# Altium schematic sheet InterfacesB_NONISO422b.SchDoc
size A; DocumentNumber: 7; SheetNumber: 7
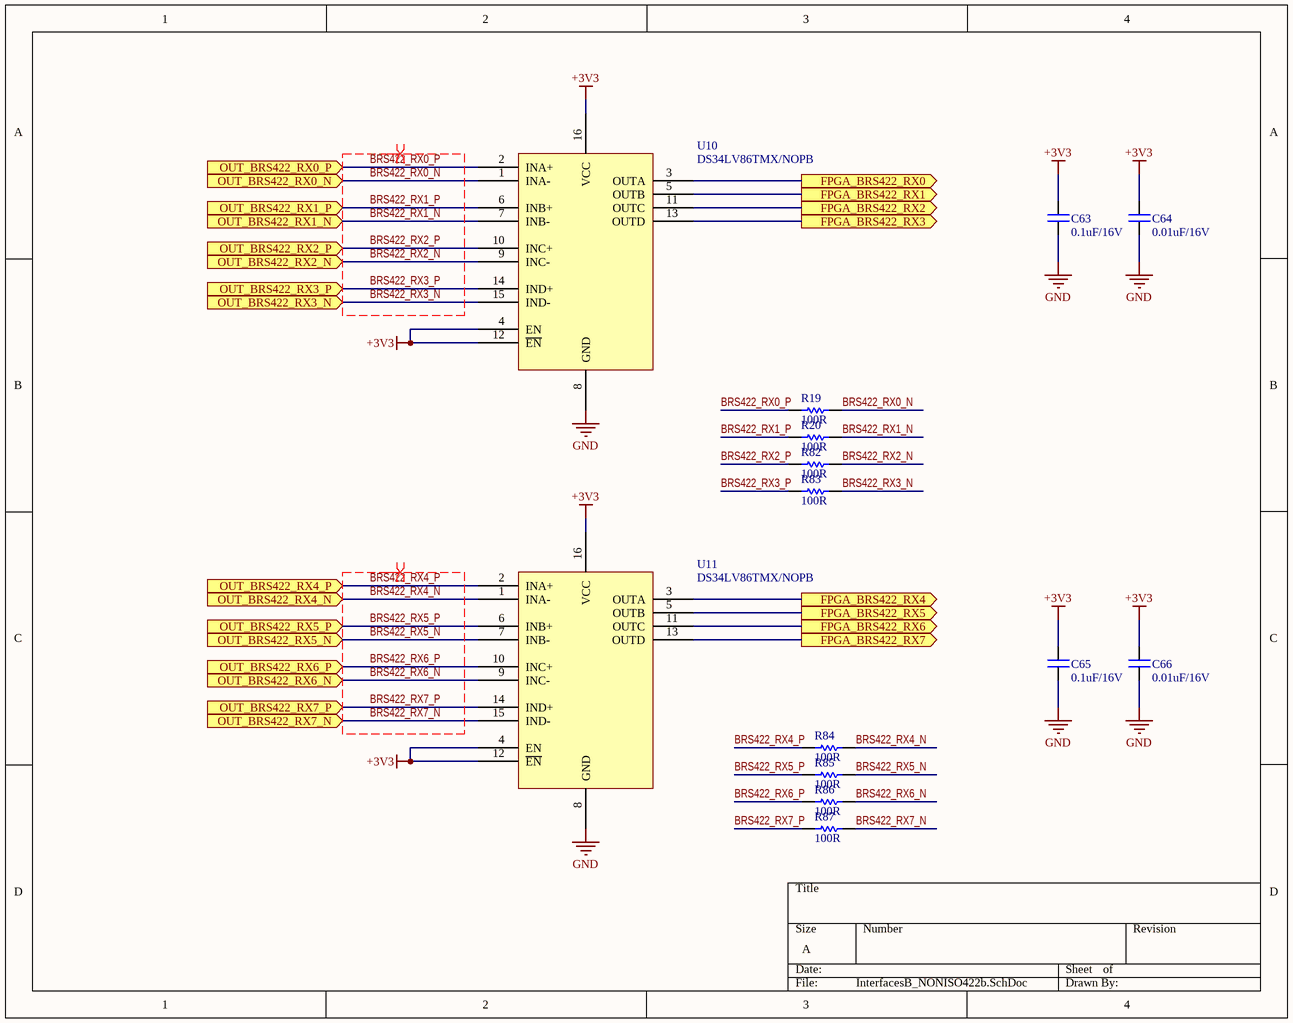
[diagram p0: InterfacesB_NONISO422b.SchDoc]

## Parts
C63  value 0.1uF/16V  [CAP_0805]  (hidden comment: CAP_0805)
C64  value 0.01uF/16V  [CAP_0805]  (hidden comment: CAP_0805)
C65  value 0.1uF/16V  [CAP_0805]  (hidden comment: CAP_0805)
C66  value 0.01uF/16V  [CAP_0805]  (hidden comment: CAP_0805)
R19  value 100R  [RES_0805]  (hidden comment: RES_0805)
R20  value 100R  [RES_0805]  (hidden comment: RES_0805)
R82  value 100R  [RES_0805]  (hidden comment: RES_0805)
R83  value 100R  [RES_0805]  (hidden comment: RES_0805)
R84  value 100R  [RES_0805]  (hidden comment: RES_0805)
R85  value 100R  [RES_0805]  (hidden comment: RES_0805)
R86  value 100R  [RES_0805]  (hidden comment: RES_0805)
R87  value 100R  [RES_0805]  (hidden comment: RES_0805)
U10  DS34LV86TMX/NOPB  [DS34LV86TMX/NOPB]
U11  DS34LV86TMX/NOPB  [DS34LV86TMX/NOPB]

## Ports
FPGA_BRS422_RX0 (out), FPGA_BRS422_RX1 (out), FPGA_BRS422_RX2 (out), FPGA_BRS422_RX3 (out), FPGA_BRS422_RX4 (out), FPGA_BRS422_RX5 (out), FPGA_BRS422_RX6 (out), FPGA_BRS422_RX7 (out), OUT_BRS422_RX0_N (in), OUT_BRS422_RX0_P (in), OUT_BRS422_RX1_N (in), OUT_BRS422_RX1_P (in), OUT_BRS422_RX2_N (in), OUT_BRS422_RX2_P (in), OUT_BRS422_RX3_N (in), OUT_BRS422_RX3_P (in), OUT_BRS422_RX4_N (in), OUT_BRS422_RX4_P (in), OUT_BRS422_RX5_N (in), OUT_BRS422_RX5_P (in), OUT_BRS422_RX6_N (in), OUT_BRS422_RX6_P (in), OUT_BRS422_RX7_N (in), OUT_BRS422_RX7_P (in)

## Nets
+3V3: C63.1 C64.1 C65.1 C66.1 U10.4(EN) U10.12(~{EN}) U10.16(VCC) U11.4(EN) U11.12(~{EN}) U11.16(VCC)
GND: C63.2 C64.2 C65.2 C66.2 U10.8(GND) U11.8(GND)
BRS422_RX0_N: R19.1 U10.1(INA-) ; port OUT_BRS422_RX0_N
BRS422_RX0_P: R19.2 U10.2(INA+) ; port OUT_BRS422_RX0_P
BRS422_RX1_N: R20.1 U10.7(INB-) ; port OUT_BRS422_RX1_N
BRS422_RX1_P: R20.2 U10.6(INB+) ; port OUT_BRS422_RX1_P
BRS422_RX2_N: R82.1 U10.9(INC-) ; port OUT_BRS422_RX2_N
BRS422_RX2_P: R82.2 U10.10(INC+) ; port OUT_BRS422_RX2_P
BRS422_RX3_N: R83.1 U10.15(IND-) ; port OUT_BRS422_RX3_N
BRS422_RX3_P: R83.2 U10.14(IND+) ; port OUT_BRS422_RX3_P
BRS422_RX4_N: R84.1 U11.1(INA-) ; port OUT_BRS422_RX4_N
BRS422_RX4_P: R84.2 U11.2(INA+) ; port OUT_BRS422_RX4_P
BRS422_RX5_N: R85.1 U11.7(INB-) ; port OUT_BRS422_RX5_N
BRS422_RX5_P: R85.2 U11.6(INB+) ; port OUT_BRS422_RX5_P
BRS422_RX6_N: R86.1 U11.9(INC-) ; port OUT_BRS422_RX6_N
BRS422_RX6_P: R86.2 U11.10(INC+) ; port OUT_BRS422_RX6_P
BRS422_RX7_N: R87.1 U11.15(IND-) ; port OUT_BRS422_RX7_N
BRS422_RX7_P: R87.2 U11.14(IND+) ; port OUT_BRS422_RX7_P
FPGA_BRS422_RX0: U10.3(OUTA) ; port FPGA_BRS422_RX0
FPGA_BRS422_RX1: U10.5(OUTB) ; port FPGA_BRS422_RX1
FPGA_BRS422_RX2: U10.11(OUTC) ; port FPGA_BRS422_RX2
FPGA_BRS422_RX3: U10.13(OUTD) ; port FPGA_BRS422_RX3
FPGA_BRS422_RX4: U11.3(OUTA) ; port FPGA_BRS422_RX4
FPGA_BRS422_RX5: U11.5(OUTB) ; port FPGA_BRS422_RX5
FPGA_BRS422_RX6: U11.11(OUTC) ; port FPGA_BRS422_RX6
FPGA_BRS422_RX7: U11.13(OUTD) ; port FPGA_BRS422_RX7

## Layout directives
differential pair: BRS422_RX0_N, BRS422_RX0_P, BRS422_RX1_N, BRS422_RX1_P, BRS422_RX2_N, BRS422_RX2_P, BRS422_RX3_N, BRS422_RX3_P, BRS422_RX4_N, BRS422_RX4_P, BRS422_RX5_N, BRS422_RX5_P, BRS422_RX6_N, BRS422_RX6_P, BRS422_RX7_N, BRS422_RX7_P

## Library data of the parts
U10 U11 = DS34LV86TMX/NOPB: Supplier 1: Digi-Key; Supplier Part Number 1: 296-13065-1-ND